# EAGLE design OW_Shield (EAGLE 5.09)
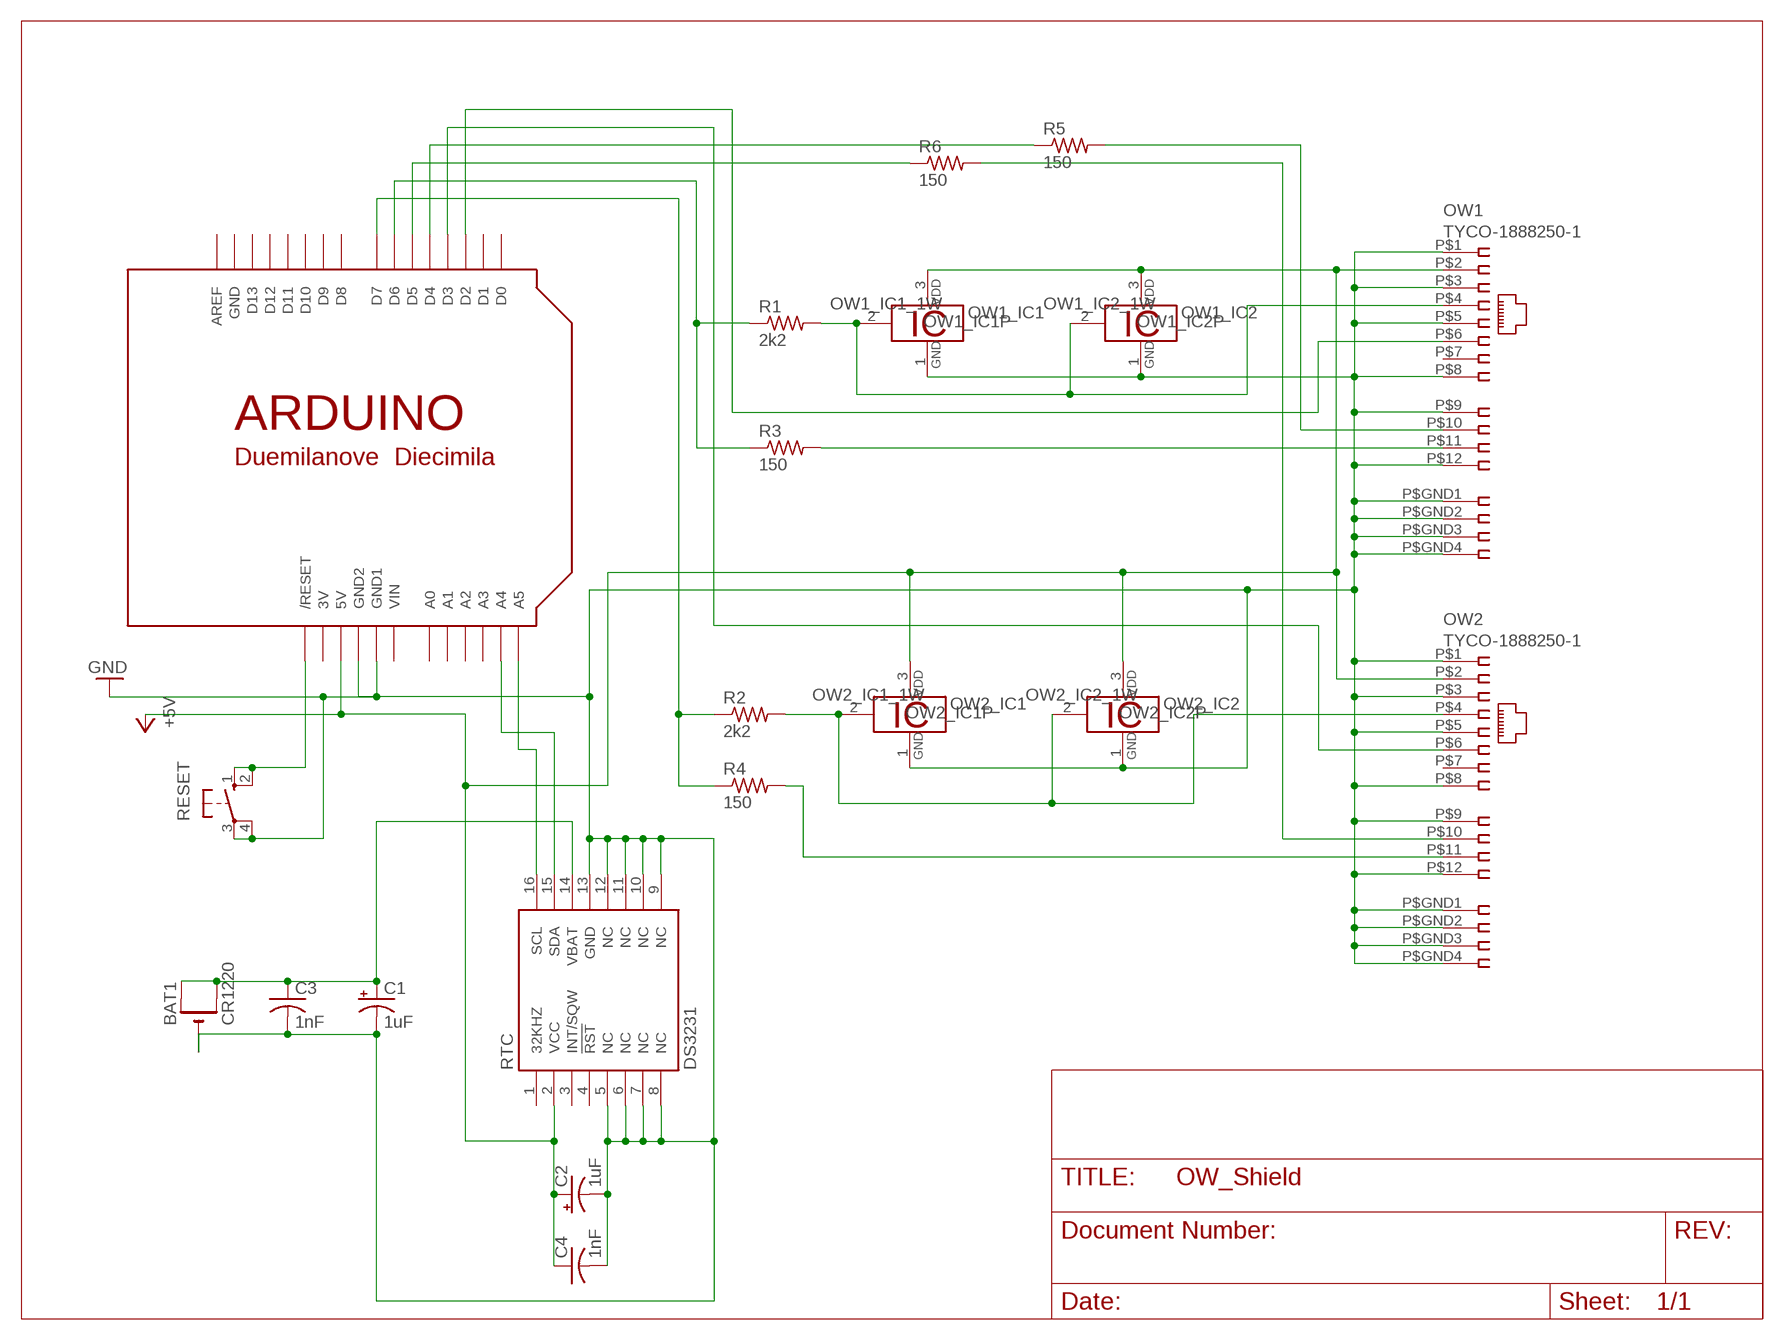
[diagram p0: schematic, sheet 1]

## Parts
BAT1  CR1220  CR1220THM  [CR1220-THM]
C1  1uF  CPOL-USE2-4  [E2-4]
C2  1uF  CPOL-USE2-4  [E2-4]
C3  1nF  C-US025-030X050  [C025-030X050]
C4  1nF  C-US025-030X050  [C025-030X050]
OW1  TYCO-1888250-1  [TYCO-1888250-1]
OW1_IC1  DS18B20  [TO92-]
OW1_IC2  DS18B20  [TO92-]
OW2  TYCO-1888250-1  [TYCO-1888250-1]
OW2_IC1  DS18B20  [TO92-]
OW2_IC2  DS18B20  [TO92-]
R1  2k2  R-US_0204/7  [0204/7]
R2  2k2  R-US_0204/7  [0204/7]
R3  150  R-US_0204/7  [0204/7]
R4  150  R-US_0204/7  [0204/7]
R5  150  R-US_0204/7  [0204/7]
R6  150  R-US_0204/7  [0204/7]
RESET  10-XX  [B3F-10XX]
RTC  DS3231  [SO-16]
U$2  ARDUINOMED  [ARDUINOMED]

## Nets
+5V: C2.+ C4.1 OW1.P$2 OW1_IC1.3 OW1_IC2.3 OW2.P$2 OW2_IC1.3 OW2_IC2.3 RTC.2(VCC) U$2.5V
GND: BAT1.- C1.- C2.- C3.2 C4.2 OW1.P$1 OW1.P$3 OW1.P$5 OW1.P$8 OW1.P$9 OW1.P$12 OW1.P$GND1(GND1) OW1.P$GND2(GND2) OW1.P$GND3(GND3) OW1.P$GND4(GND4) OW1_IC1.1 OW1_IC2.1 OW2.P$1 OW2.P$3 OW2.P$5 OW2.P$8 OW2.P$9 OW2.P$12 OW2.P$GND1(GND1) OW2.P$GND2(GND2) OW2.P$GND3(GND3) OW2.P$GND4(GND4) OW2_IC1.1 OW2_IC2.1 RESET.3(P) RESET.4(P1) RTC.5(NC) RTC.6(NC) RTC.7(NC) RTC.8(NC) RTC.9(NC) RTC.10(NC) RTC.11(NC) RTC.12(NC) RTC.13(GND) U$2.GND1(GND2) U$2.GND(GND1)
N$1: RTC.15(SDA) U$2.A4
N$2: RTC.16(SCL) U$2.A5
N$4: R1.1 R3.1 U$2.D6
N$5: R2.1 R4.1 U$2.D7
N$6: OW2.P$10 R6.2
N$7: OW1.P$10 R5.2
N$9: R5.1 U$2.D4
N$10: OW2.P$6 U$2.D3
N$11: OW1.P$6 U$2.D2
N$12: R6.1 U$2.D5
N$13: OW2.P$11 R4.2
N$14: OW1.P$11 R3.2
N$15: BAT1.+1(+) BAT1.+2(+1) C1.+ C3.1 RTC.14(VBAT)
N$16: RESET.1(S) RESET.2(S1) U$2.RESET(/RESET)
OW1: OW1.P$4 OW1_IC1.2 OW1_IC2.2 R1.2
OW2: OW2.P$4 OW2_IC1.2 OW2_IC2.2 R2.2
Unconnected: OW1.P$7 OW2.P$7 RTC.1(32KHZ) RTC.3(INT/SQW) RTC.4(!RST) U$2.A0 U$2.A1 U$2.A2 U$2.A3 U$2.AREF U$2.D0 U$2.D1 U$2.D8 U$2.D9 U$2.D10 U$2.D11 U$2.D12 U$2.D13

## Power pins joined to a net without a drawn wire
3V: U$2.3V
GND: U$2.GND2(GND)
VIN: U$2.VIN

## Library data of the parts
BAT1 = adafruit:CR1220: CR1216/CR1220/CR1225 12mm 3V lithium coin cell Great for battery packup. Both SMT and THM holders. Note the THM package has the ground pads on both sides of the PCB so that the masks are the same - this reduces the cost
C1 C2 = adafruit:CPOL-US: POLARIZED CAPACITOR, American symbol
C3 C4 = adafruit:C-US: CAPACITOR, American symbol
OW1 OW2 = gfb:TYCO-1888250-1
OW1_IC1 OW1_IC2 OW2_IC1 OW2_IC2 = 1wire:DS18B20: Programmable Resolution Digital Thermometer This chip provides a onewire thermosensor with approx. 0.5°C accuracy. A programmable over/undertemperure alarm is available. The precision can be set from 9..12 bits. Notes: Vdd must be applied for accurate measurements at low temperatures, as the parasite power circuit otherwise heats the sensor. If parasite power is used, Vdd has to be connected to GND. The DS1822 is a low-cost thermometer chip, the DS18S20 is similar to the DS18B20, but with 9 Bit precision only. Author: Jan Kandziora <jjj@gmx.de>
R1-R6 = resistor:R-US_: RESISTOR, American symbol
RESET = switch-omron:10-XX: OMRON SWITCH
RTC = ds3231:DS3231: DS3231 RTC
U$2 = gfb:ARDUINOMED: Medium coverage Arduino shield

## Board
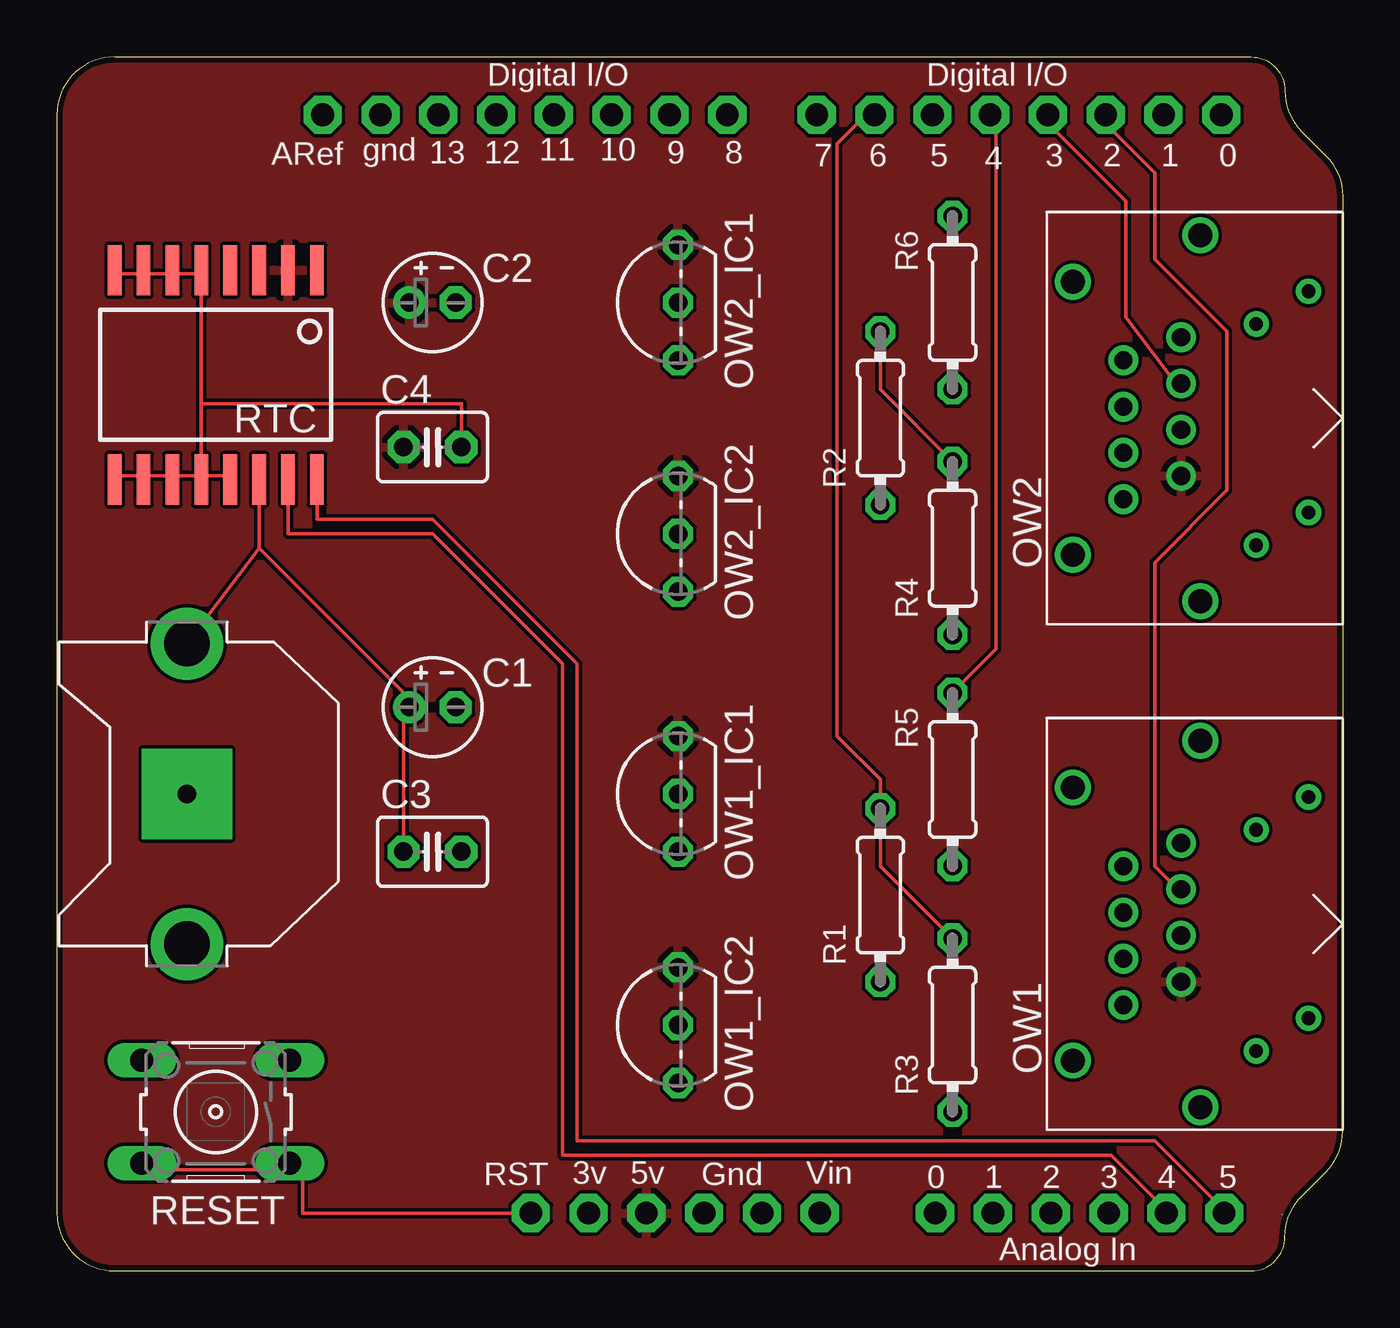
[diagram p1: board, top side]
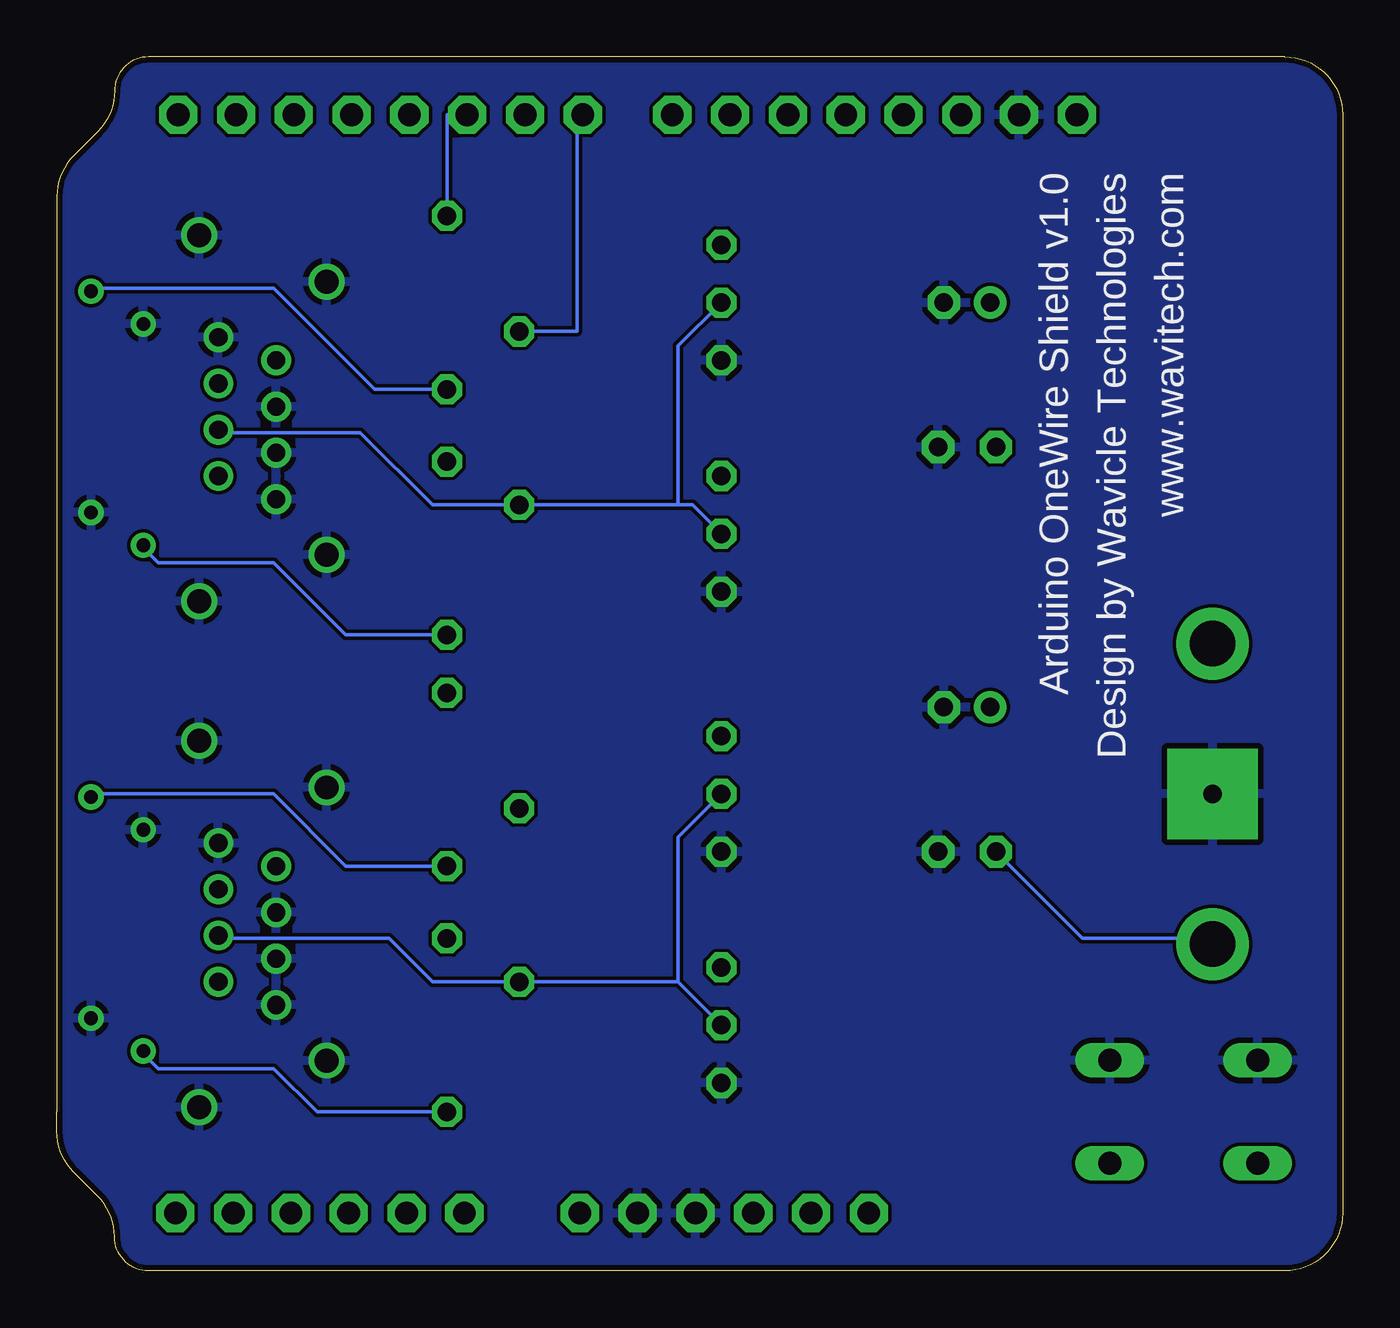
[diagram p2: board, bottom side, seen from below]

Size 56.52 x 53.34 mm. Coordinates in mm from the lower left corner, seen from the top.
Copper layers (1*16): Top 0.035mm / dielectric 1.5mm / Bottom 0.035mm
Design rules "Fusion_eagle_rule_v1.1": minimum track width 6mil, minimum drill 12mil, track to track 6mil, track to pad 6mil, pad to pad 6mil, via to via 6mil, smd to smd 0mil, copper to edge 10mil, drill to drill 10mil, minimum pad ring 10mil, minimum via ring 6mil, stop-mask expansion 2mil, vias tented up to drill 100mil, thermal gap 10mil

### Footprints (pad centres in the part's own frame; a part is rotated, then mirrored left to right if it is on the bottom)
CR1220-THM = drill 2 pad 3.175 round: +1 -6.604,0; +2 6.604,0 | drill 0.8 pad 3.962 square: - 0,0
E2-4 = drill 0.813 pad 1.422 round: + -1.016,0 | drill 0.813 pad 1.422 octagon: - 1.016,0
C025-030X050 = drill 0.813 pad 1.422 octagon: 1 -1.27,0; 2 1.27,0
TYCO-1888250-1 = drill 0.8 pad 1.3 round: P$1 -3.556,9.64; P$2 -2.54,7.1; P$3 -1.524,9.64; P$4 -0.508,7.1; P$5 0.508,9.64; P$6 1.524,7.1; P$7 2.54,9.64; P$8 3.556,7.1 | drill 0.6 pad 1.1 round: P$9 4.14,3.8; P$10 5.58,1.5; P$11 -5.58,3.8; P$12 -4.14,1.5 | drill 1.05 pad 1.55 round: P$GND1 -6,11.85; P$GND2 -8.045,6.25; P$GND3 6,11.85; P$GND4 8.045,6.25
TO92- = drill 0.813 octagon: 1 -2.54,0; 2 0,0; 3 2.54,0
0204/7 = drill 0.813 octagon: 1 -3.81,0; 2 3.81,0
B3F-10XX = drill 1.016 long: 1 -3.251,2.261; 2 3.251,2.261; 3 -3.251,-2.261; 4 3.251,-2.261
SO-16 = smd 0.6 x 2.2: 1 -4.445,-4.6; 2 -3.175,-4.6; 3 -1.905,-4.6; 4 -0.635,-4.6; 5 0.635,-4.6; 6 1.905,-4.6; 7 3.175,-4.6; 8 4.445,-4.6; 9 4.445,4.6; 10 3.175,4.6; 11 1.905,4.6; 12 0.635,4.6; 13 -0.635,4.6; 14 -1.905,4.6; 15 -3.175,4.6; 16 -4.445,4.6
ARDUINOMED = drill 1 pad 1.676 octagon: 3V 23.368,2.54; 5V 25.908,2.54; A0 38.608,2.54; A1 41.148,2.54; A2 43.688,2.54; A3 46.228,2.54; A4 48.768,2.54; A5 51.308,2.54; AREF 11.684,50.8; D0 51.181,50.8; D1 48.641,50.8; D2 46.101,50.8; D3 43.561,50.8; D4 41.021,50.8; D5 38.481,50.8; D6 35.941,50.8; D7 33.401,50.8; D8 29.464,50.8; D9 26.924,50.8; D10 24.384,50.8; D11 21.844,50.8; D12 19.304,50.8; D13 16.764,50.8; GND 14.224,50.8; GND1 30.988,2.54; GND2 28.448,2.54; RESET 20.828,2.54; VIN 33.528,2.54

### Placement (x,y rotation side)
BAT1  5.71,20.95 90 top
C1  16.51,24.77 0 top
C2  16.51,42.55 0 top
C3  16.51,18.41 0 top
C4  16.51,36.2 0 top
OW1  56.52,15.24 90 top
OW1_IC1  27.3,20.95 90 top
OW1_IC2  27.3,10.79 90 top
OW2  56.52,37.47 90 top
OW2_IC1  27.3,42.55 90 top
OW2_IC2  27.3,32.38 90 top
R1  36.2,16.51 270 top
R2  36.2,37.47 270 top
R3  39.37,10.79 270 top
R4  39.37,31.75 270 top
R5  39.37,21.59 270 top
R6  39.37,42.55 270 top
RESET  6.99,6.99 180 top
RTC  6.99,39.37 180 top
U$2  0,0 0 top

### Tracks (layer width: path | path; a pad name or v marks a point on that pad's centre or on a via)
+5V
  pour Top: -1.27,-1.27 58.42,-1.27 58.42,53.98 -1.27,53.98
GND
  Top 0.152: 3.81,43.81 2.54,43.81 RTC.8 | 5.08,43.81 3.81,43.81 | 3.81,43.81 RTC.7 | 6.35,43.81 5.08,43.81 | 5.08,43.81 RTC.6 | 3.81,34.92 2.54,34.92 RTC.9 | 3.81,34.92 5.08,34.92 | RTC.10 3.81,34.92 | 5.08,34.92 6.35,34.92 | 5.08,34.92 RTC.11 | 6.35,34.92 7.62,34.92 RTC.13 | 6.35,34.92 6.35,38.1 | 6.35,38.1 6.35,43.81 | 6.35,43.81 RTC.5 | 6.35,34.92 RTC.12 | 6.35,38.1 17.78,38.1 C4.2
  pour Bottom: -1.91,54.61 59.05,54.61 59.05,-1.91 -1.91,-1.91
N$1
  Top 0.152: U$2.A4 48.9,2.54 46.35,5.08 22.23,5.08 22.23,26.67 16.51,32.38 10.16,32.38 RTC.15
N$2
  Top 0.152: RTC.16 11.43,33.02 16.51,33.02 22.86,26.67 22.86,5.71 48.26,5.71 50.8,3.17 U$2.A5
N$4
  Top 0.152: R3.1 36.2,17.78 R1.1 36.2,21.59 34.29,23.5 34.29,49.53 35.56,50.8 U$2.D6
N$5
  Top 0.152: R4.1 36.2,38.73 R2.1
  Bottom 0.152: R2.1 33.66,41.27 33.66,50.8 U$2.D7
N$6
  Bottom 0.152: R6.2 42.55,38.73 46.99,43.18 54.61,43.18 OW2.P$10
N$7
  Bottom 0.152: R5.2 43.81,17.78 46.99,20.95 54.61,20.95 OW1.P$10
N$9
  Top 0.152: R5.1 41.27,27.3 41.27,50.8 U$2.D4
N$10
  Top 0.152: OW2.P$6 48.9,39.37 46.99,41.91 46.99,46.99 43.81,50.16 43.81,50.8 U$2.D3
N$11
  Top 0.152: OW1.P$6 48.9,17.14 48.26,17.78 48.26,31.11 51.44,34.29 51.44,41.27 48.26,44.45 48.26,48.26 46.35,50.16 46.35,50.8 U$2.D2
N$12
  Bottom 0.152: R6.1 39.37,50.8 U$2.D5
N$13
  Bottom 0.152: R4.2 43.81,27.94 46.99,31.11 52.07,31.11 52.7,31.75 OW2.P$11
N$14
  Bottom 0.152: R3.2 45.09,6.99 46.99,8.89 52.07,8.89 52.7,9.53 OW1.P$11
N$15
  Top 0.152: 8.89,31.75 RTC.14 | 8.89,31.75 BAT1.+2 | C3.1 15.24,24.77 | 8.89,31.75 15.24,25.4 15.24,24.77 | 15.24,24.77 C1.+
  Bottom 0.152: C3.1 11.43,14.61 5.71,14.61 BAT1.+1
N$16
  Top 0.152: RESET.2 3.81,4.45 10.16,4.45 RESET.1 10.79,4.45 10.79,2.54 U$2.RESET
OW1
  Bottom 0.152: OW1.P$4 48.9,14.61 41.91,14.61 40.01,12.7 R1.2 29.21,12.7 | OW1_IC2.2 29.21,12.7 | OW1_IC1.2 29.21,19.05 29.21,12.7
OW2
  Bottom 0.152: OW2.P$4 48.9,36.83 43.18,36.83 40.01,33.66 R2.2 29.21,33.66 | OW2_IC2.2 28.57,33.66 29.21,33.66 | OW2_IC1.2 29.21,40.64 29.21,33.66

### Text on the board
bNames: www.wavitech.com | Design by Wavicle Technologies | Arduino OneWire Shield v1.0